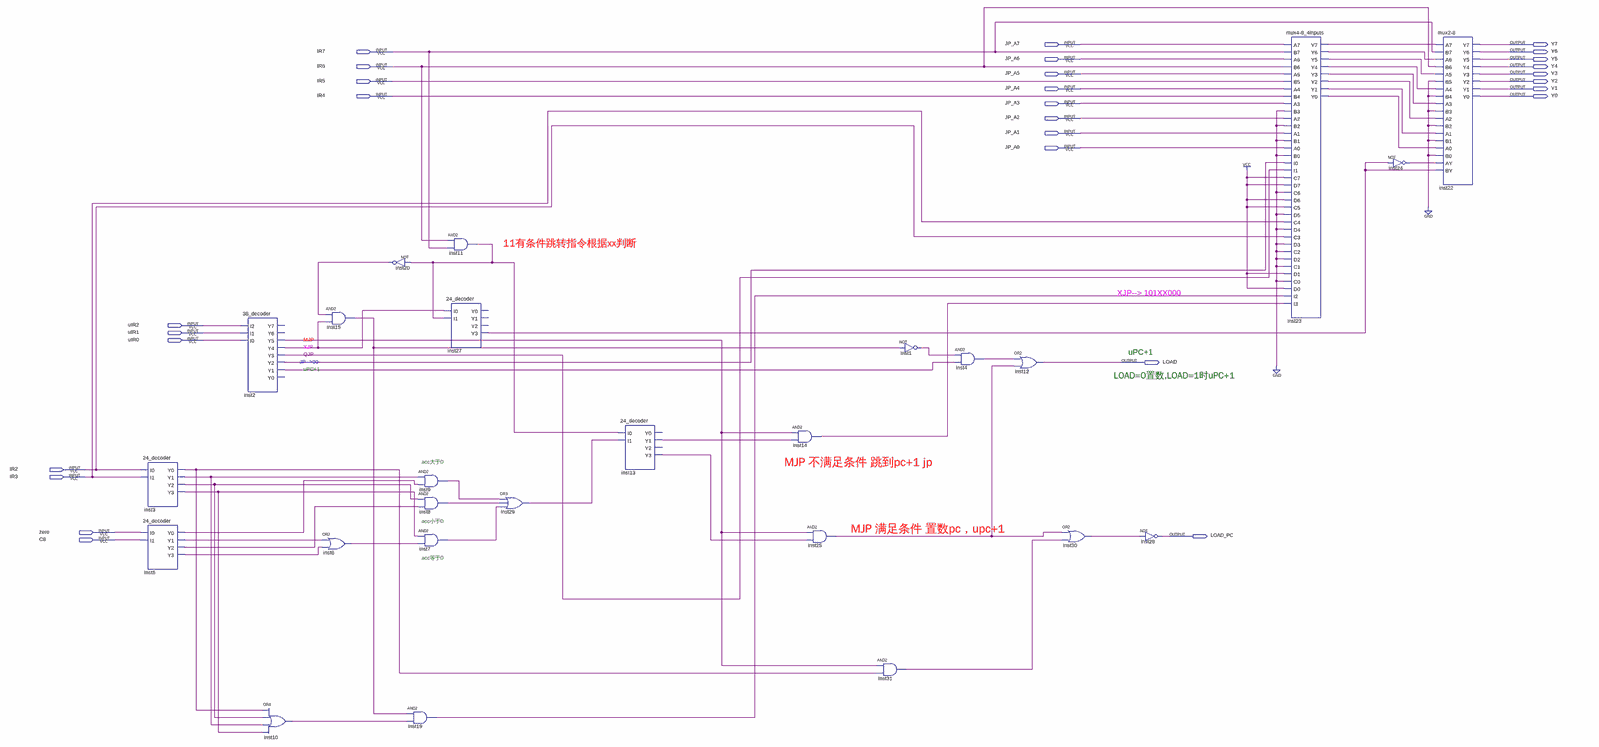
[diagram p0: schematic sheet, whole]
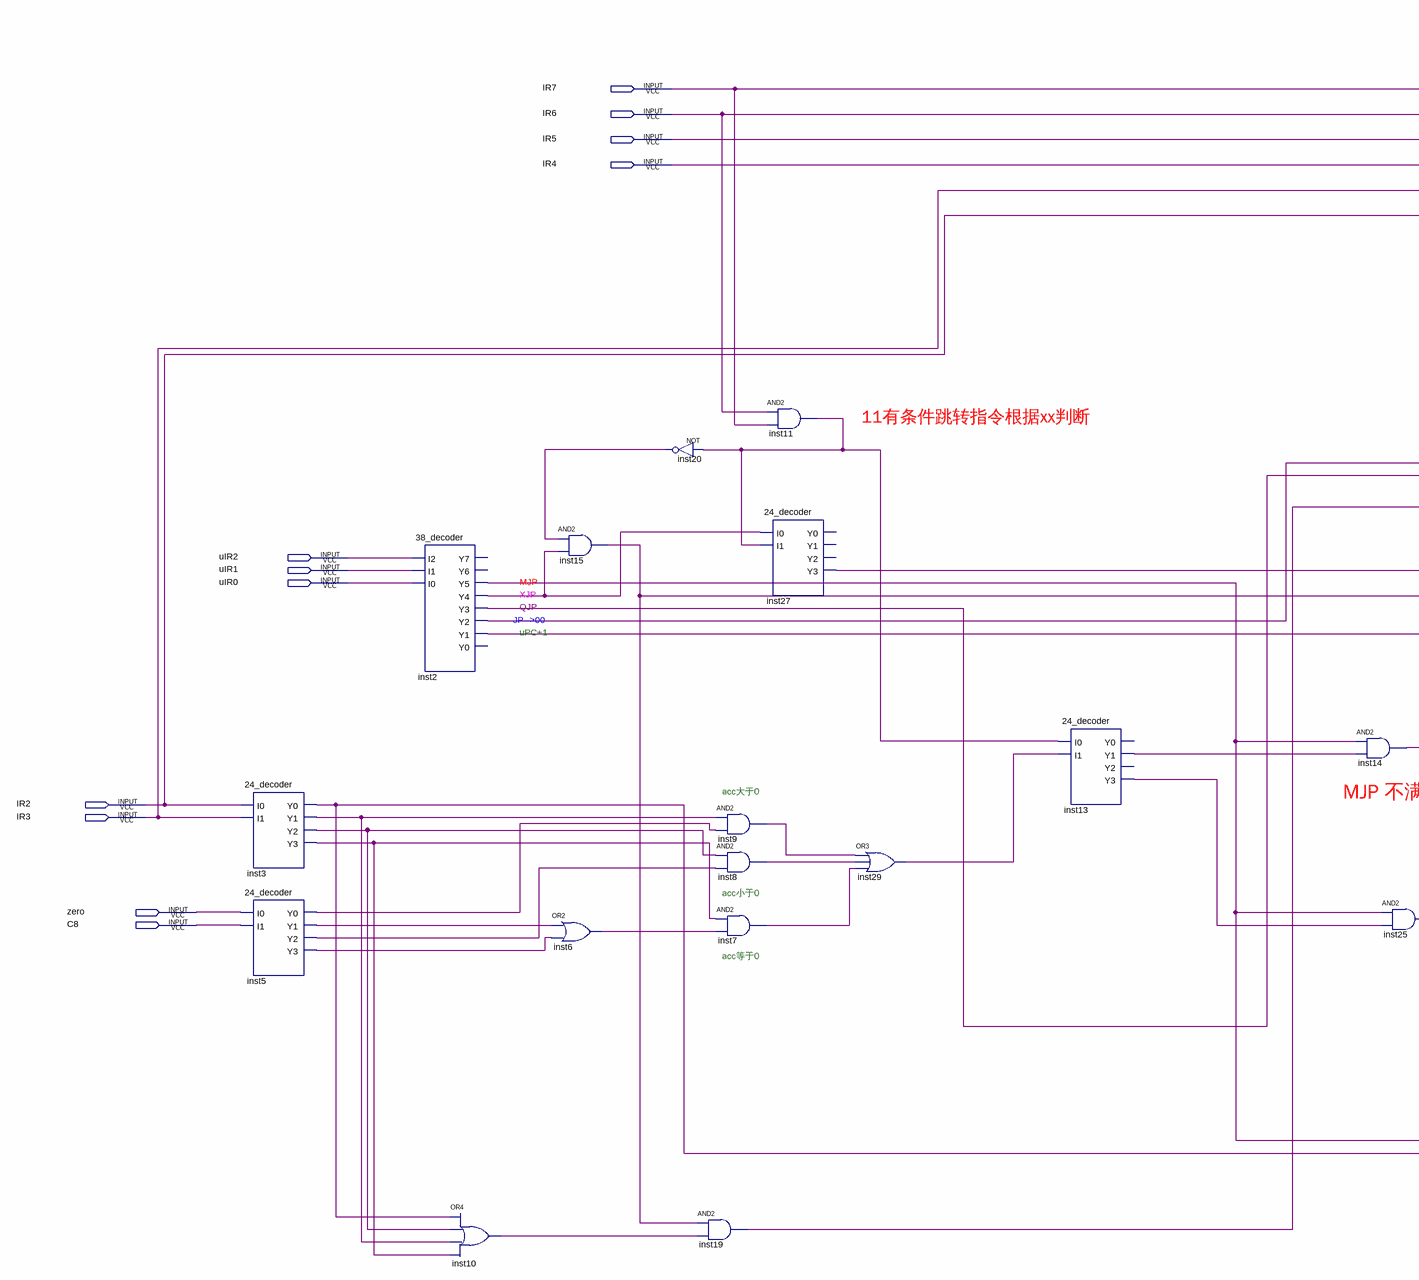
[diagram p1: schematic sheet, left part]
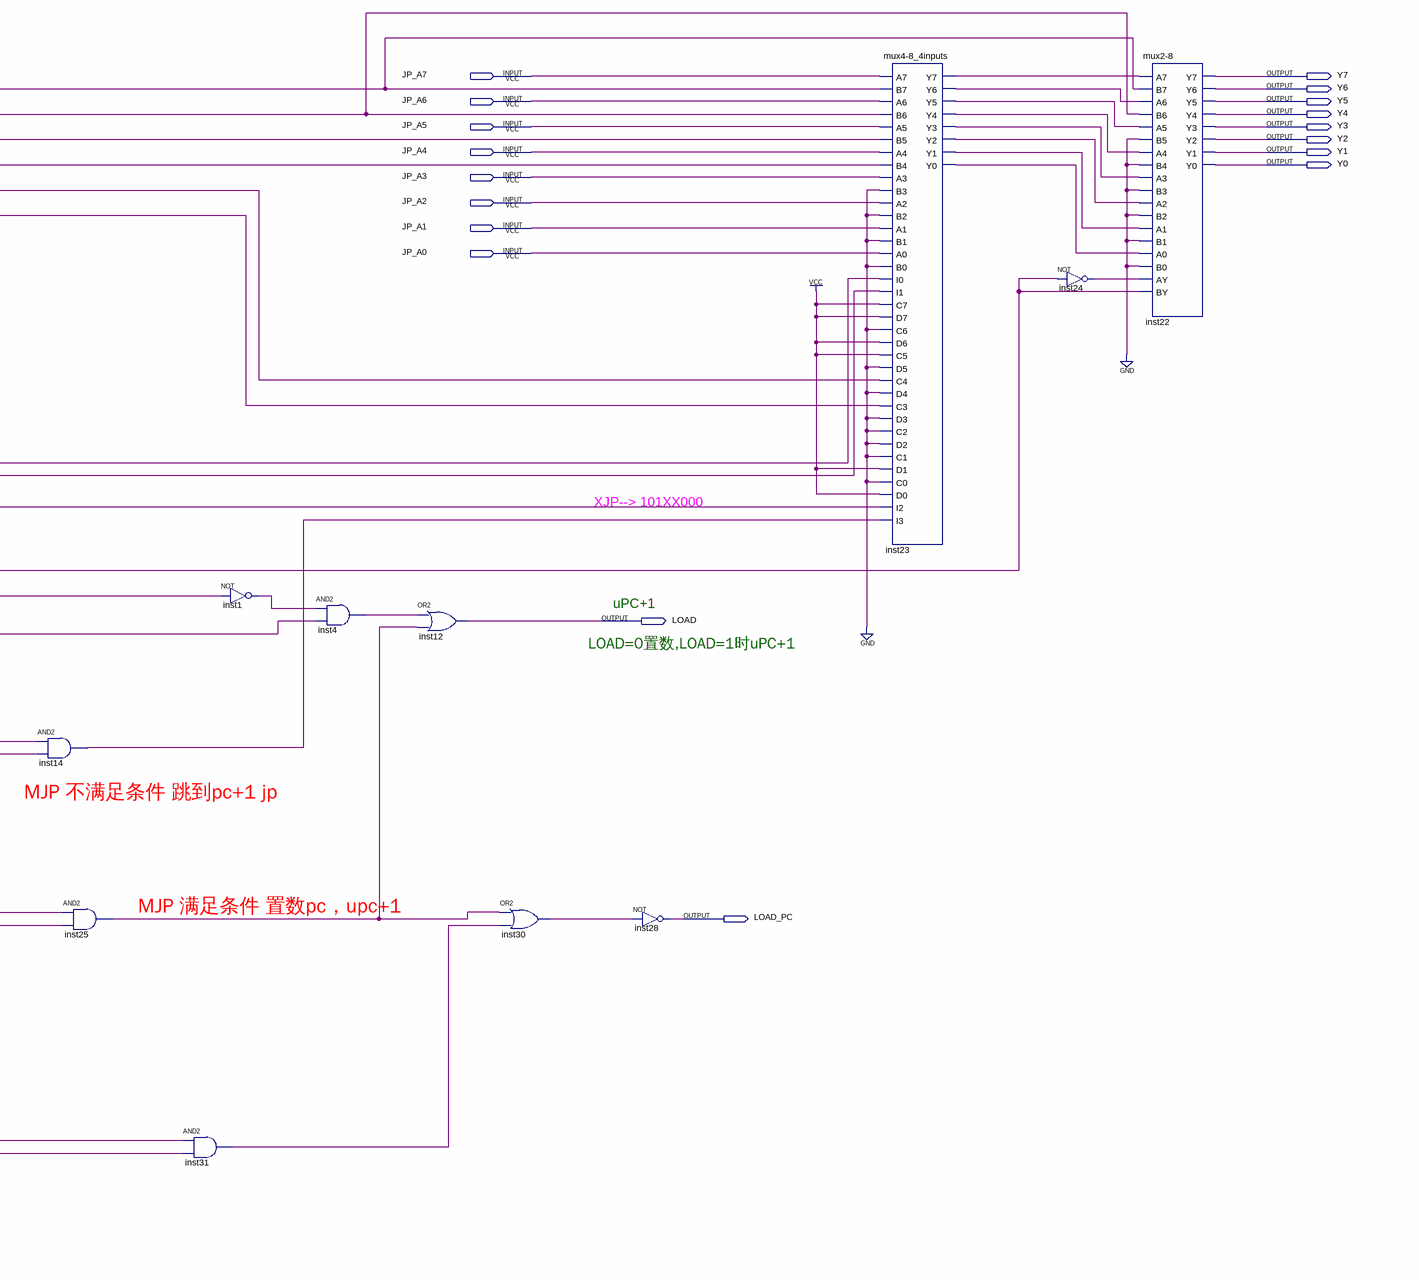
[diagram p2: schematic sheet, right part]
// Quartus schematic micro_address_generator.bdf as structural Verilog: 26 symbols, 29 pins
module micro_address_generator (
  input  JP_A7,
  input  IR7,
  input  JP_A6,
  input  IR6,
  input  JP_A5,
  input  IR5,
  input  JP_A4,
  input  IR4,
  input  JP_A3,
  input  JP_A2,
  input  JP_A1,
  input  JP_A0,
  input  uIR2,
  input  uIR1,
  input  uIR0,
  input  IR2,
  input  IR3,
  input  zero,
  input  C8,
  output Y7,
  output Y6,
  output Y5,
  output Y4,
  output Y3,
  output Y2,
  output Y1,
  output Y0,
  output LOAD,
  output LOAD_PC
);

  wire inst1_out, inst2_y1, inst2_y2, inst2_y3, inst2_y4, inst2_y5, inst3_y0, inst3_y1, inst3_y2, inst3_y3,
       inst4_out, inst5_y0, inst5_y1, inst5_y2, inst5_y3, inst6_out, inst7_out, inst8_out, inst9_out,
       inst10_out, inst11_out, inst13_y1, inst13_y3, inst14_out, inst15_out, inst19_out, inst20_out,
       inst23_y0, inst23_y1, inst23_y2, inst23_y3, inst23_y4, inst23_y5, inst23_y6, inst23_y7, inst24_out,
       inst25_out, inst27_y3, inst29_out, inst30_out, inst31_out;

  \24_decoder  inst3 (.I0(IR2), .I1(IR3), .Y0(inst3_y0), .Y1(inst3_y1), .Y2(inst3_y2), .Y3(inst3_y3));
  \24_decoder  inst5 (.I0(zero), .I1(C8), .Y0(inst5_y0), .Y1(inst5_y1), .Y2(inst5_y2), .Y3(inst5_y3));
  \38_decoder  inst2 (
    .I2(uIR2), .I1(uIR1), .I0(uIR0), .Y5(inst2_y5), .Y4(inst2_y4), .Y3(inst2_y3), .Y2(inst2_y2), .Y1(inst2_y1));  // open: Y7, Y6, Y0
  or inst10 (inst10_out, inst3_y0, inst3_y2, inst3_y1, inst3_y3);
  or inst6 (inst6_out, inst5_y1, inst5_y3);
  and inst15 (inst15_out, inst20_out, inst2_y4);
  not inst20 (inst20_out, inst11_out);
  and inst19 (inst19_out, inst15_out, inst10_out);
  and inst9 (inst9_out, inst3_y1, inst5_y0);
  and inst8 (inst8_out, inst3_y2, inst5_y2);
  and inst7 (inst7_out, inst3_y3, inst6_out);
  and inst11 (inst11_out, IR6, IR7);
  \24_decoder  inst27 (.I0(inst2_y4), .I1(inst11_out), .Y3(inst27_y3));  // open: Y0, Y1, Y2
  or inst29 (inst29_out, inst9_out, inst8_out, inst7_out);
  \24_decoder  inst13 (.I0(inst11_out), .I1(inst29_out), .Y1(inst13_y1), .Y3(inst13_y3));  // open: Y0, Y2
  and inst14 (inst14_out, inst2_y5, inst13_y1);
  and inst25 (inst25_out, inst2_y5, inst13_y3);
  and inst31 (inst31_out, inst2_y5, inst3_y0);
  not inst1 (inst1_out, inst15_out);
  and inst4 (inst4_out, inst1_out, inst2_y1);
  or inst12 (LOAD, inst4_out, inst25_out);
  or inst30 (inst30_out, inst25_out, inst31_out);
  not inst28 (LOAD_PC, inst30_out);
  \mux4-8_4inputs  inst23 (
    .A7(JP_A7), .B7(IR7), .A6(JP_A6), .B6(IR6), .A5(JP_A5), .B5(IR5), .A4(JP_A4), .B4(IR4), .A3(JP_A3),
    .B3(1'b0), .A2(JP_A2), .B2(1'b0), .A1(JP_A1), .B1(1'b0), .A0(JP_A0), .B0(1'b0), .I0(inst2_y2),
    .I1(inst2_y3), .C7(1'b1), .D7(1'b1), .C6(1'b0), .D6(1'b1), .C5(1'b1), .D5(1'b0), .C4(IR3), .D4(1'b0),
    .C3(IR2), .D3(1'b0), .C2(1'b0), .D2(1'b0), .C1(1'b0), .D1(1'b1), .C0(1'b0), .D0(1'b1), .I2(inst19_out),
    .I3(inst14_out), .Y7(inst23_y7), .Y6(inst23_y6), .Y5(inst23_y5), .Y4(inst23_y4), .Y3(inst23_y3),
    .Y2(inst23_y2), .Y1(inst23_y1), .Y0(inst23_y0));
  not inst24 (inst24_out, inst27_y3);
  \mux2-8  inst22 (
    .A7(inst23_y7), .B7(IR7), .A6(inst23_y6), .B6(IR6), .A5(inst23_y5), .B5(1'b0), .A4(inst23_y4), .B4(1'b0),
    .A3(inst23_y3), .B3(1'b0), .A2(inst23_y2), .B2(1'b0), .A1(inst23_y1), .B1(1'b0), .A0(inst23_y0),
    .B0(1'b0), .AY(inst24_out), .BY(inst27_y3), .Y7(Y7), .Y6(Y6), .Y5(Y5), .Y4(Y4), .Y3(Y3), .Y2(Y2),
    .Y1(Y1), .Y0(Y0));

  // Notes on the sheet:
  //   11有条件跳转指令根据xx判断
  //   XJP--> 101XX000
  //   MJP
  //   XJP
  //   uPC+1
  //   QJP
  //   JP-->00
  //   uPC+1
  //   LOAD=0置数,LOAD=1时uPC+1
  //   MJP 不满足条件 跳到pc+1 jp
  //   acc大于0
  //   acc小于0
  //   MJP 满足条件 置数pc，upc+1
  //   acc等于0
endmodule
